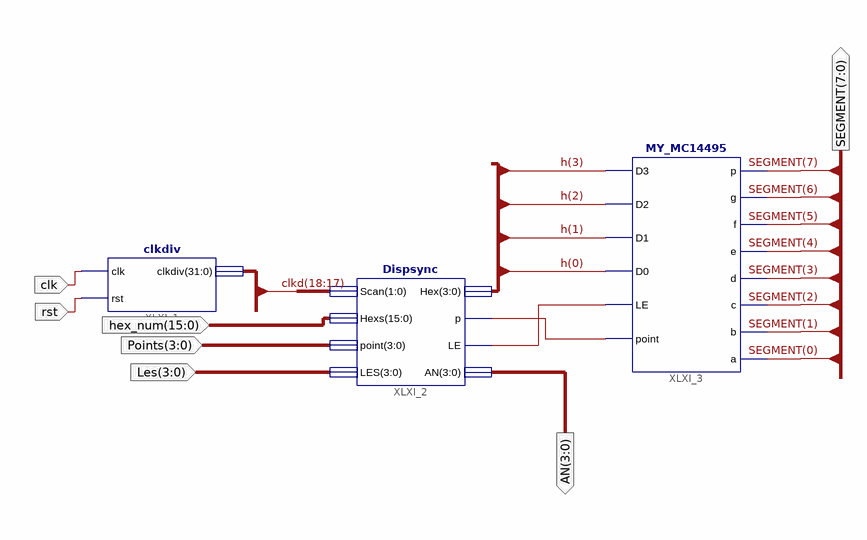
[diagram p0: schematic sheet 1]
// Xilinx ISE schematic disp_num.sch (spartan3) as structural Verilog: 3 symbols, 7 ports
module disp_num (
  input  clk,
  input  rst,
  input  [15:0] hex_num,
  input  [3:0] Points,
  input  [3:0] Les,
  output [3:0] AN,
  output [7:0] SEGMENT
);

  wire XLXN_13, XLXN_14;
  wire [3:0] h;
  wire [31:0] clkd;

  clkdiv XLXI_1 (.clk(clk), .rst(rst), .clkdiv(clkd));
  Dispsync XLXI_2 (
    .Scan(clkd[18:17]), .Hexs(hex_num), .point(Points), .LES(Les), .Hex(h), .p(XLXN_13), .LE(XLXN_14), .AN(AN));
  MY_MC14495 XLXI_3 (
    .D3(h[3]), .D2(h[2]), .D1(h[1]), .D0(h[0]), .LE(XLXN_14), .point(XLXN_13), .p(SEGMENT[7]),
    .g(SEGMENT[6]), .f(SEGMENT[5]), .e(SEGMENT[4]), .d(SEGMENT[3]), .c(SEGMENT[2]), .b(SEGMENT[1]),
    .a(SEGMENT[0]));
endmodule
